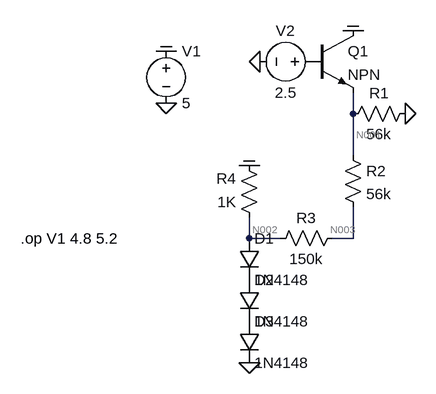
[diagram p0: schematic Osciloscope.asc]
Osciloscope.asc, the LTspice schematic file:
Version 4
SHEET 1 880 680
WIRE 256 224 256 192
WIRE 256 288 256 224
WIRE 96 416 96 384
WIRE 144 416 96 416
WIRE 256 416 256 368
WIRE 256 416 224 416
FLAG -32 208 0
FLAG -32 128 COM
FLAG 112 144 0
FLAG 256 96 COM
FLAG 96 304 Com
FLAG 336 224 0
FLAG 96 608 0
SYMBOL voltage -32 112 R0
WINDOW 123 0 0 Left 2
WINDOW 39 0 0 Left 2
SYMATTR InstName V1
SYMATTR Value 5
SYMBOL npn 192 96 R0
SYMATTR InstName Q1
SYMBOL voltage 208 144 R90
WINDOW 0 -32 56 VBottom 2
WINDOW 3 32 56 VTop 2
WINDOW 123 0 0 Left 2
WINDOW 39 0 0 Left 2
SYMATTR InstName V2
SYMATTR Value 2.5
SYMBOL res 352 208 R90
WINDOW 0 0 56 VBottom 2
WINDOW 3 32 56 VTop 2
SYMATTR InstName R1
SYMATTR Value 56k
SYMBOL res 240 272 R0
SYMATTR InstName R2
SYMATTR Value 56k
SYMBOL res 240 400 R90
WINDOW 0 0 56 VBottom 2
WINDOW 3 32 56 VTop 2
SYMATTR InstName R3
SYMATTR Value 150k
SYMBOL res 112 400 R180
WINDOW 0 36 76 Left 2
WINDOW 3 36 40 Left 2
SYMATTR InstName R4
SYMATTR Value 1K
SYMBOL diode 80 416 R0
SYMATTR InstName D1
SYMATTR Value 1N4148
SYMBOL diode 80 480 R0
SYMATTR InstName D2
SYMATTR Value 1N4148
SYMBOL diode 80 544 R0
SYMATTR InstName D3
SYMATTR Value 1N4148
TEXT -256 416 Left 2 !.op V1 4.8 5.2

The netlist it stands for:
* Osciloscope.asc
V1 COM 0 5
Q1 COM P001 N001 0 NPN
V2 P001 0 2.5
R1 0 N001 56k
R2 N001 N003 56k
R3 N003 N002 150k
R4 N002 COM 1K
D1 N002 P002 1N4148
D2 P002 P003 1N4148
D3 P003 0 1N4148
.model D D
.lib standard.dio
.model NPN NPN
.model PNP PNP
.lib standard.bjt
.op V1 4.8 5.2
.backanno
.end

* Results of the author's LTspice run, read from the files saved beside the schematic
* Operating Point:
*   V(com) = 5 V
*   V(p001) = 2.5 V
*   V(n001) = 1.815 V
*   V(n003) = 1.841 V
*   V(n002) = 1.911 V
*   V(p002) = 1.274 V
*   V(p003) = 637 mV
*   Ic(Q1) = 31.63 µA
*   Ib(Q1) = 316.3 nA
*   Ie(Q1) = -31.95 µA
*   I(D3) = 3.088 mA
*   I(D2) = 3.088 mA
*   I(D1) = 3.088 mA
*   I(R4) = -3.089 mA
*   I(R3) = -465.9 nA
*   I(R2) = -465.9 nA
*   I(R1) = -32.41 µA
*   I(V2) = -316.3 nA
*   I(V1) = -3.121 mA
* From the log:
*   Semiconductor Device Operating Points:
*                           --- Diodes ---
*   Name:      d3          d2          d1
*   Model:   1n4148      1n4148      1n4148
*   Id:      3.09e-03    3.09e-03    3.09e-03
*   Vd:      6.37e-01    6.37e-01    6.37e-01
*   Req:     1.47e+01    1.47e+01    1.47e+01
*   CAP:     1.37e-09    1.37e-09    1.37e-09
*                           --- Bipolar Transistors ---
*   Name:       q1
*   Model:      npn
*   Ib:       3.16e-07
*   Ic:       3.16e-05
*   Vbe:      6.85e-01
*   Vbc:     -2.50e+00
*   Vce:      3.18e+00
*   BetaDC:   1.00e+02
*   Gm:       1.22e-03
*   Rpi:      8.18e+04
*   Rx:       0.00e+00
*   Ro:       2.45e+56
*   Cbe:      0.00e+00
*   Cbc:      0.00e+00
*   Cjs:      0.00e+00
*   BetaAC:   1.00e+02
*   Cbx:      0.00e+00
*   Ft:       0.00e+00